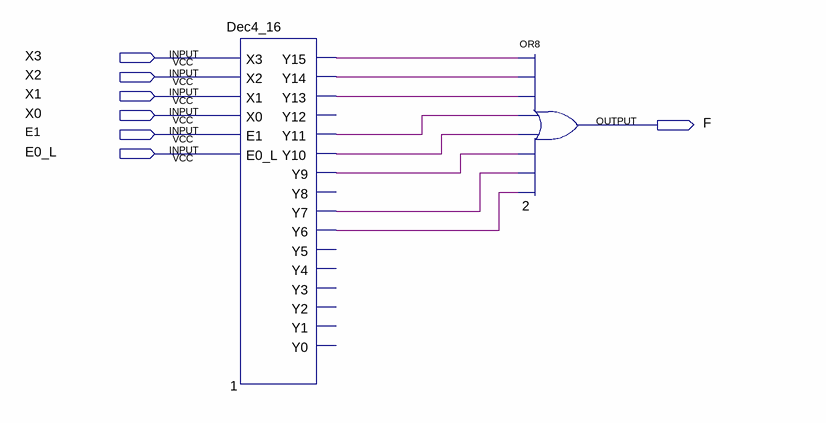
[diagram p0: schematic sheet]
// Quartus schematic DecDemo3.bdf as structural Verilog: 2 symbols, 7 pins
module DecDemo3 (
  input  X3,
  input  X2,
  input  X1,
  input  X0,
  input  E1,
  input  E0_L,
  output F
);

  wire n1_y6, n1_y7, n1_y9, n1_y10, n1_y11, n1_y13, n1_y14, n1_y15;

  Dec4_16 u_1 (
    .X3(X3), .X2(X2), .X1(X1), .X0(X0), .E1(E1), .E0_L(E0_L), .Y15(n1_y15), .Y14(n1_y14), .Y13(n1_y13),
    .Y11(n1_y11), .Y10(n1_y10), .Y9(n1_y9), .Y7(n1_y7), .Y6(n1_y6));  // open: Y12, Y8, Y5, Y4, Y3, Y2, Y1, Y0
  or u_2 (F, n1_y15, n1_y14, n1_y13, n1_y11, n1_y10, n1_y9, n1_y7, n1_y6);
endmodule
